# EAGLE design p128b (EAGLE 9.6.2)
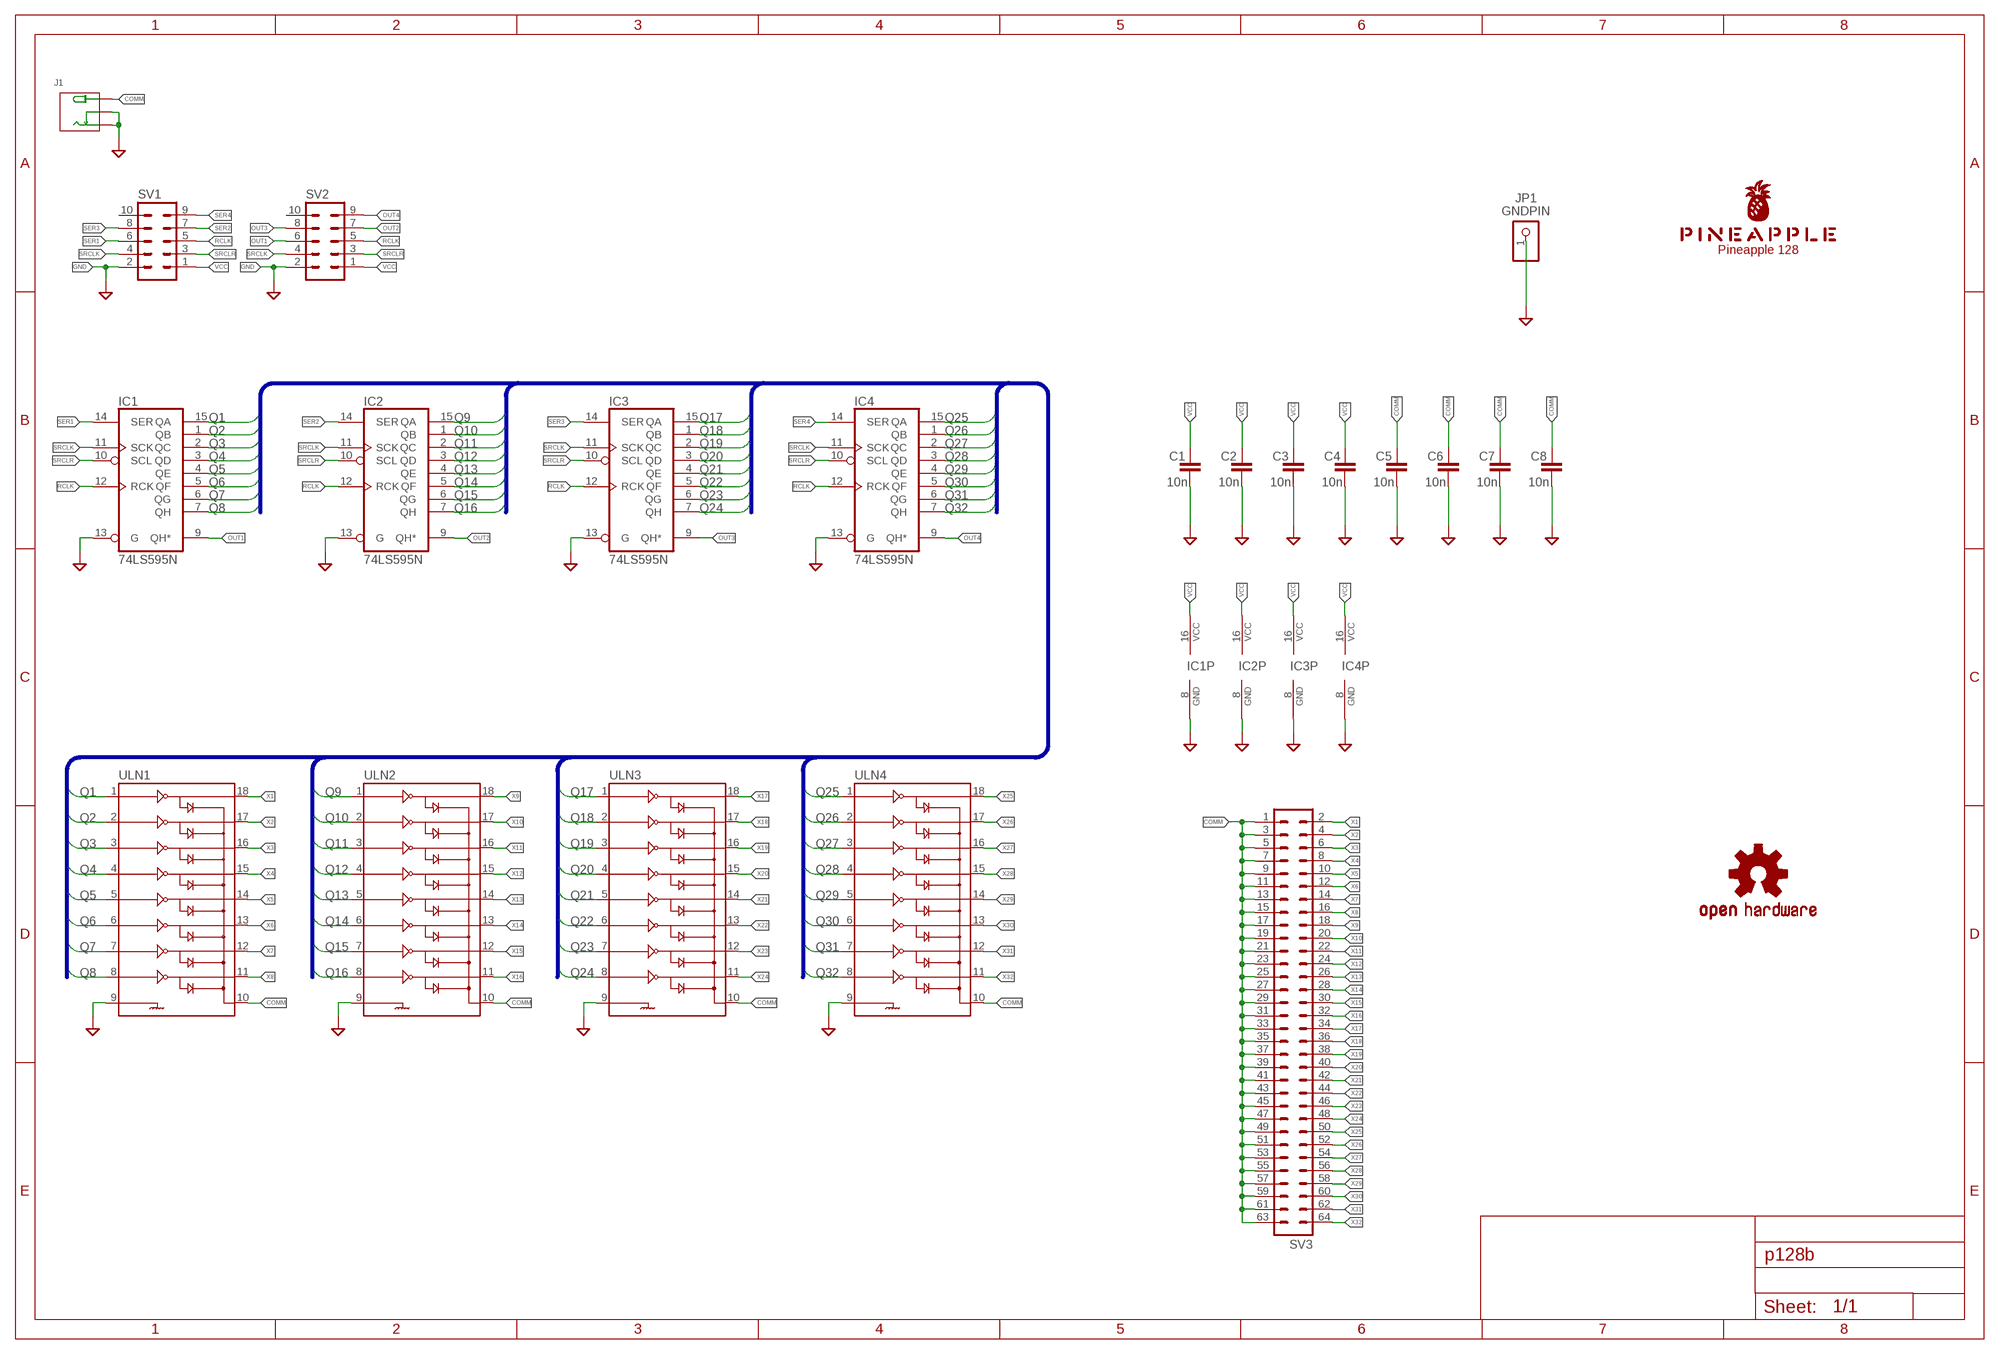
[diagram p0: schematic, sheet 1]

## Parts
C1  10n  C-EU025-024X044  [C025-024X044]
C2  10n  C-EU025-024X044  [C025-024X044]
C3  10n  C-EU025-024X044  [C025-024X044]
C4  10n  C-EU025-024X044  [C025-024X044]
C5  10n  C-EU025-024X044  [C025-024X044]
C6  10n  C-EU025-024X044  [C025-024X044]
C7  10n  C-EU025-024X044  [C025-024X044]
C8  10n  C-EU025-024X044  [C025-024X044]
IC1  74LS595N  [DIL16]
IC2  74LS595N  [DIL16]
IC3  74LS595N  [DIL16]
IC4  74LS595N  [DIL16]
J1  JACK-DC-005'DC-005'  [3P-L14.2*W11.0*H9.0MM]
JP1  GNDPIN  PINHD-1X1  [1X01]
LOGO1  OSHW-LOGOS-COPPER  [OSHW-LOGO-S_COPPER]
SV1  ML10L  [ML10L]
SV2  ML10L  [ML10L]
SV3  ML64L  [ML64L]
U$1  PINEAPPLE450_SILK  [PINEAPPLE450_SILK]
ULN1  ULN2803DIP  [DIL18]
ULN2  ULN2803DIP  [DIL18]
ULN3  ULN2803DIP  [DIL18]
ULN4  ULN2803DIP  [DIL18]

## Nets
COMM [power]: C5.1 C6.1 C7.1 C8.1 J1.+ SV3.1 SV3.3 SV3.5 SV3.7 SV3.9 SV3.11 SV3.13 SV3.15 SV3.17 SV3.19 SV3.21 SV3.23 SV3.25 SV3.27 SV3.29 SV3.31 SV3.33 SV3.35 SV3.37 SV3.39 SV3.41 SV3.43 SV3.45 SV3.47 SV3.49 SV3.51 SV3.53 SV3.55 SV3.57 SV3.59 SV3.61 SV3.63 ULN1.10 ULN2.10 ULN3.10 ULN4.10
GND [gnd]: C1.2 C2.2 C3.2 C4.2 C5.2 C6.2 C7.2 C8.2 IC1.8(GND) IC1.13(G) IC2.8(GND) IC2.13(G) IC3.8(GND) IC3.13(G) IC4.8(GND) IC4.13(G) J1.-1(-) J1.-2(CDN) JP1.1 SV1.2 SV2.2 ULN1.9 ULN2.9 ULN3.9 ULN4.9
OUT1: IC1.9(QH*) SV2.6
OUT2: IC2.9(QH*) SV2.7
OUT3: IC3.9(QH*) SV2.8
OUT4: IC4.9(QH*) SV2.9
Q1: IC1.15(QA) ULN1.1
Q2: IC1.1(QB) ULN1.2
Q3: IC1.2(QC) ULN1.3
Q4: IC1.3(QD) ULN1.4
Q5: IC1.4(QE) ULN1.5
Q6: IC1.5(QF) ULN1.6
Q7: IC1.6(QG) ULN1.7
Q8: IC1.7(QH) ULN1.8
Q9: IC2.15(QA) ULN2.1
Q10: IC2.1(QB) ULN2.2
Q11: IC2.2(QC) ULN2.3
Q12: IC2.3(QD) ULN2.4
Q13: IC2.4(QE) ULN2.5
Q14: IC2.5(QF) ULN2.6
Q15: IC2.6(QG) ULN2.7
Q16: IC2.7(QH) ULN2.8
Q17: IC3.15(QA) ULN3.1
Q18: IC3.1(QB) ULN3.2
Q19: IC3.2(QC) ULN3.3
Q20: IC3.3(QD) ULN3.4
Q21: IC3.4(QE) ULN3.5
Q22: IC3.5(QF) ULN3.6
Q23: IC3.6(QG) ULN3.7
Q24: IC3.7(QH) ULN3.8
Q25: IC4.15(QA) ULN4.1
Q26: IC4.1(QB) ULN4.2
Q27: IC4.2(QC) ULN4.3
Q28: IC4.3(QD) ULN4.4
Q29: IC4.4(QE) ULN4.5
Q30: IC4.5(QF) ULN4.6
Q31: IC4.6(QG) ULN4.7
Q32: IC4.7(QH) ULN4.8
RCLK: IC1.12(RCK) IC2.12(RCK) IC3.12(RCK) IC4.12(RCK) SV1.5 SV2.5
SER1: IC1.14(SER) SV1.6
SER2: IC2.14(SER) SV1.7
SER3: IC3.14(SER) SV1.8
SER4: IC4.14(SER) SV1.9
SRCLK: IC1.11(SCK) IC2.11(SCK) IC3.11(SCK) IC4.11(SCK) SV1.4 SV2.4
SRCLR: IC1.10(SCL) IC2.10(SCL) IC3.10(SCL) IC4.10(SCL) SV1.3 SV2.3
VCC [power]: C1.1 C2.1 C3.1 C4.1 IC1.16(VCC) IC2.16(VCC) IC3.16(VCC) IC4.16(VCC) SV1.1 SV2.1
X1: SV3.2 ULN1.18
X2: SV3.4 ULN1.17
X3: SV3.6 ULN1.16
X4: SV3.8 ULN1.15
X5: SV3.10 ULN1.14
X6: SV3.12 ULN1.13
X7: SV3.14 ULN1.12
X8: SV3.16 ULN1.11
X9: SV3.18 ULN2.18
X10: SV3.20 ULN2.17
X11: SV3.22 ULN2.16
X12: SV3.24 ULN2.15
X13: SV3.26 ULN2.14
X14: SV3.28 ULN2.13
X15: SV3.30 ULN2.12
X16: SV3.32 ULN2.11
X17: SV3.34 ULN3.18
X18: SV3.36 ULN3.17
X19: SV3.38 ULN3.16
X20: SV3.40 ULN3.15
X21: SV3.42 ULN3.14
X22: SV3.44 ULN3.13
X23: SV3.46 ULN3.12
X24: SV3.48 ULN3.11
X25: SV3.50 ULN4.18
X26: SV3.52 ULN4.17
X27: SV3.54 ULN4.16
X28: SV3.56 ULN4.15
X29: SV3.58 ULN4.14
X30: SV3.60 ULN4.13
X31: SV3.62 ULN4.12
X32: SV3.64 ULN4.11
Unconnected: SV1.10 SV2.10

## Buses
Q[1..64]

## Notes on the sheet
- Pineapple 128

## Library data of the parts
C1-C4 C6-C8 = resistor:C-EU: CAPACITOR, European symbol
C5 = rcl:C-EU: CAPACITOR, European symbol; SPICEPREFIX: C
IC1-IC4 = 74xx-us:74*595: 8-bit SHIFT REGISTER, output latch
J1 = Seeed-Connector:JACK-DC-005: 320120003
JP1 = pinhead:PINHD-1X1: PIN HEADER
LOGO1 = SparkFun-Aesthetics:OSHW-LOGO: Open-Source Hardware (OSHW) Logo This logo indicates the piece of hardware it is found on incorporates a OSHW license and/or adheres to the definition of open source hardware found here: http://freedomdefined.org/OSHW
SV1 SV2 = con-ml:ML10L: HARTING; OC_FARNELL: unknown; OC_NEWARK: unknown
SV3 = con-ml:ML64L: HARTING; OC_FARNELL: unknown; OC_NEWARK: unknown
U$1 = pineapple:PINEAPPLE450_SILK
ULN1-ULN4 = SparkFun-IC-Special-Function:ULN2803: Darlington Driver(IC-07959, low stock) ULN2803 Darlington array. 500mA max per channel, 8-channel package. Spark Fun Electronics SKU : COM-00312

## Net classes
0 default: width 0.152 mm, drill 0.152 mm, clearance 0.152 mm
1 gnd: width 0.61 mm, drill 0.152 mm, clearance 0.152 mm
2 power: width 0.61 mm, drill 0.152 mm, clearance 0.152 mm
3 analog: width 0.305 mm, drill 0.152 mm, clearance 0.152 mm

## Board
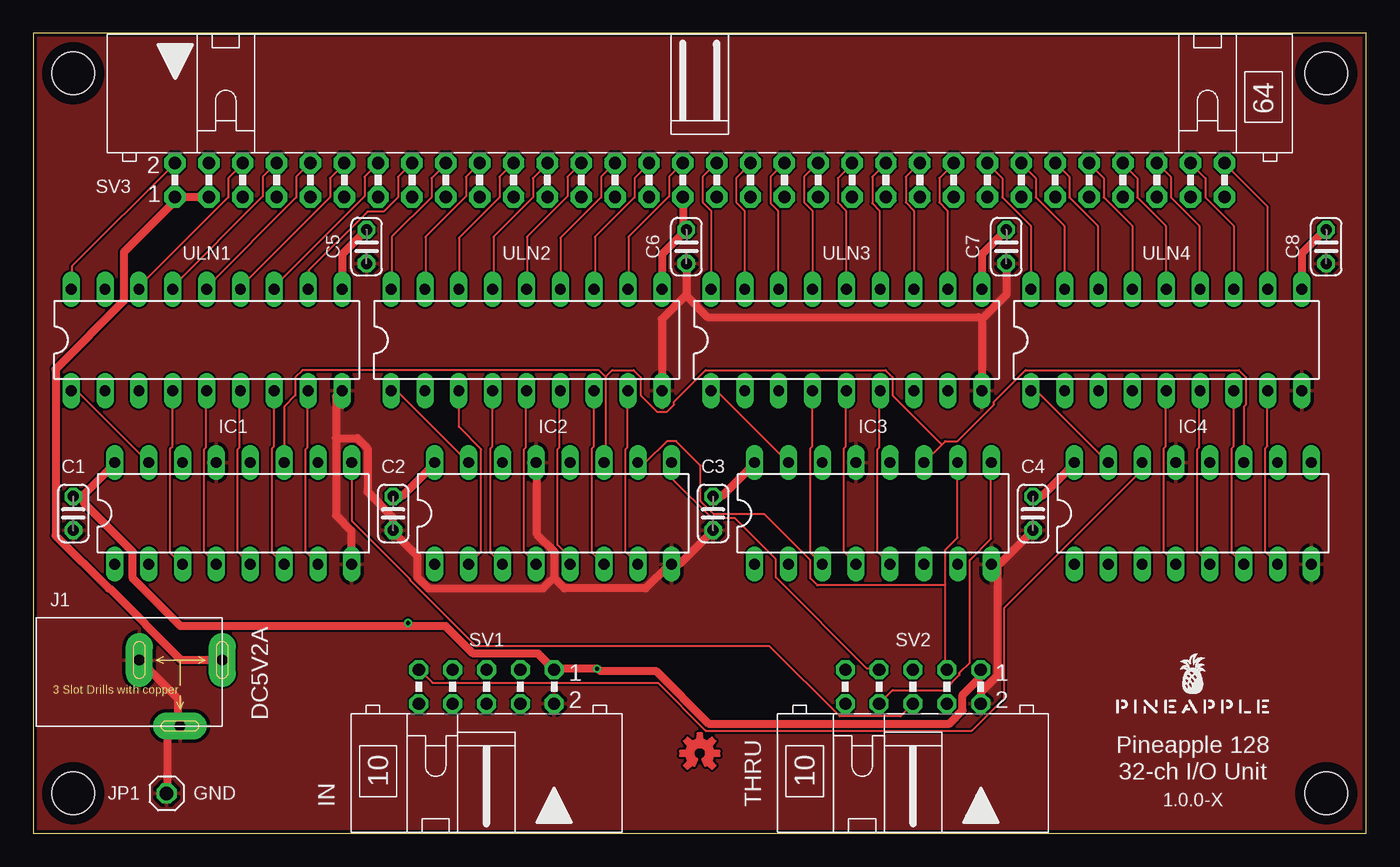
[diagram p1: board, top side]
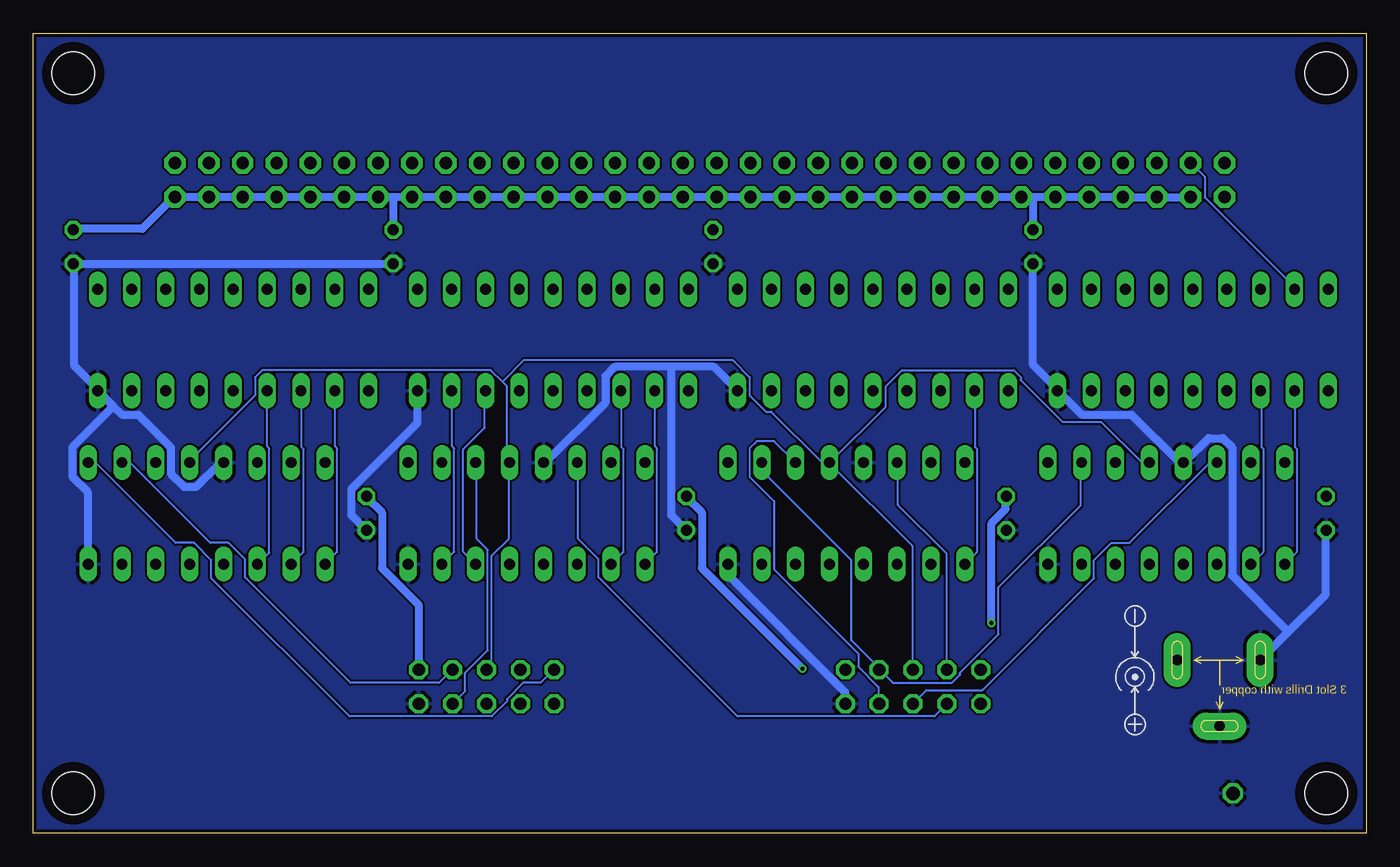
[diagram p2: board, bottom side, seen from below]

Size 100 x 60 mm. Coordinates in mm from the lower left corner, seen from the top.
Outline: 0,0 100,0 100,60 0,60 0,0
Copper layers (1*16): Top 0.035mm / dielectric 1.5mm / Bottom 0.035mm
Design rules "SeeedStudio_2layer_DRU_no_angle_20140221": minimum track width 6mil, minimum drill 12mil, track to track 6mil, track to pad 6mil, pad to pad 6mil, via to via 6mil, smd to smd 0mil, copper to edge 10mil, drill to drill 10mil, minimum pad ring 10mil, minimum via ring 6mil, stop-mask expansion 2mil, vias tented up to drill 100mil, thermal gap 10mil
Holes 3.2 mm at 3,3 97,3 97,57 3,57
tRestrict: area 0.8,54.8 to 5.2,59.2; area 94.8,54.8 to 99.2,59.2; area 0.8,0.8 to 5.2,5.2; area 94.8,0.8 to 99.2,5.2
bRestrict: area 0.8,0.8 to 5.2,5.2; area 94.8,0.8 to 99.2,5.2; area 94.8,54.8 to 99.2,59.2; area 0.8,54.8 to 5.2,59.2

### Footprints (pad centres in the part's own frame; a part is rotated, then mirrored left to right if it is on the bottom)
C025-024X044 = drill 0.813 octagon: 1 -1.27,0; 2 1.27,0
DIL16 = drill 0.813 long: 1 -8.89,-3.81; 2 -6.35,-3.81; 3 -3.81,-3.81; 4 -1.27,-3.81; 5 1.27,-3.81; 6 3.81,-3.81; 7 6.35,-3.81; 8 8.89,-3.81; 9 8.89,3.81; 10 6.35,3.81; 11 3.81,3.81; 12 1.27,3.81; 13 -1.27,3.81; 14 -3.81,3.81; 15 -6.35,3.81; 16 -8.89,3.81
3P-L14.2*W11.0*H9.0MM = drill 0.813 pad 2.032 long: + 3.175,0; -1 -3.048,0; -2 0,-4.953
1X01 = drill 1.016 octagon: 1 0,0
ML10L = drill 0.914 octagon: 1 -5.08,-1.27; 2 -5.08,1.27; 3 -2.54,-1.27; 4 -2.54,1.27; 5 0,-1.27; 6 0,1.27; 7 2.54,-1.27; 8 2.54,1.27; 9 5.08,-1.27; 10 5.08,1.27
ML64L = drill 0.914 pad 1.6 octagon: 1 -39.37,-1.27; 2 -39.37,1.27; 3 -36.83,-1.27; 4 -36.83,1.27; 5 -34.29,-1.27; 6 -34.29,1.27; 7 -31.75,-1.27; 8 -31.75,1.27; 9 -29.21,-1.27; 10 -29.21,1.27; 11 -26.67,-1.27; 12 -26.67,1.27; 13 -24.13,-1.27; 14 -24.13,1.27; 15 -21.59,-1.27; 16 -21.59,1.27; 17 -19.05,-1.27; 18 -19.05,1.27; 19 -16.51,-1.27; 20 -16.51,1.27; 21 -13.97,-1.27; 22 -13.97,1.27; 23 -11.43,-1.27; 24 -11.43,1.27; 25 -8.89,-1.27; 26 -8.89,1.27; 27 -6.35,-1.27; 28 -6.35,1.27; 29 -3.81,-1.27; 30 -3.81,1.27; 31 -1.27,-1.27; 32 -1.27,1.27; 33 1.27,-1.27; 34 1.27,1.27; 35 3.81,-1.27; 36 3.81,1.27; 37 6.35,-1.27; 38 6.35,1.27; 39 8.89,-1.27; 40 8.89,1.27; 41 11.43,-1.27; 42 11.43,1.27; 43 13.97,-1.27; 44 13.97,1.27; 45 16.51,-1.27; 46 16.51,1.27; 47 19.05,-1.27; 48 19.05,1.27; 49 21.59,-1.27; 50 21.59,1.27; 51 24.13,-1.27; 52 24.13,1.27; 53 26.67,-1.27; 54 26.67,1.27; 55 29.21,-1.27; 56 29.21,1.27; 57 31.75,-1.27; 58 31.75,1.27; 59 34.29,-1.27; 60 34.29,1.27; 61 36.83,-1.27; 62 36.83,1.27; 63 39.37,-1.27; 64 39.37,1.27
DIL18 = drill 0.813 long: 1 -10.16,-3.81; 2 -7.62,-3.81; 3 -5.08,-3.81; 4 -2.54,-3.81; 5 0,-3.81; 6 2.54,-3.81; 7 5.08,-3.81; 8 7.62,-3.81; 9 10.16,-3.81; 10 10.16,3.81; 11 7.62,3.81; 12 5.08,3.81; 13 2.54,3.81; 14 0,3.81; 15 -2.54,3.81; 16 -5.08,3.81; 17 -7.62,3.81; 18 -10.16,3.81

### Placement (x,y rotation side)
C1  3,24 270 top
C2  27,24 270 top
C3  51,24 270 top
C4  75,24 270 top
C5  25,44 270 top
C6  49,44 270 top
C7  73,44 270 top
C8  97,44 270 top
IC1  15,24 0 top
IC2  39,24 0 top
IC3  63,24 0 top
IC4  87,24 0 top
J1  11,13 0 top
JP1  10,3 0 top
LOGO1  50,6 0 top
SV1  34,11 180 top
SV2  66,11 180 top
SV3  50,49 0 top
U$1  87,9 0 top
ULN1  13,37 0 top
ULN2  37,37 0 top
ULN3  61,37 0 top
ULN4  85,37 0 top

### Tracks (layer width: path | path; a pad name or v marks a point on that pad's centre or on a via)
COMM
  Top 0.61: ULN4.10 95.17,40.84 95.17,43.51 96.93,45.26 C8.1 | ULN3.10 71.17,40.84 71.17,43.43 C7.1 | ULN2.10 47.17,40.84 47.17,43.43 C6.1 48.77,45.49 48.77,47.7 SV3.31 | ULN1.10 23.16,40.84 23.16,43.43 C5.1 | SV3.3 13.11,47.7 10.67,47.7 SV3.1 10.59,47.4 6.78,43.59 6.78,39.93 1.68,34.82 1.68,22.33 5.64,18.36 5.71,18.36 11.05,13.03 14.17,13.03 J1.+
  Bottom 0.61: 73,47.7 71.86,47.7 SV3.49 71.55,47.7 69.34,47.7 SV3.47 69.04,47.7 66.75,47.7 SV3.45 66.45,47.7 64.24,47.7 SV3.43 63.93,47.7 61.72,47.7 SV3.41 61.42,47.7 59.13,47.7 SV3.39 58.83,47.7 56.62,47.7 SV3.37 56.31,47.7 54.1,47.7 SV3.35 53.8,47.7 51.51,47.7 SV3.33 51.21,47.7 48.77,47.7 SV3.31 48.46,47.7 46.48,47.7 SV3.29 46.18,47.7 43.89,47.7 SV3.27 43.59,47.7 41.38,47.7 SV3.25 41.07,47.7 38.86,47.7 SV3.23 38.56,47.7 36.27,47.7 SV3.21 35.97,47.7 33.76,47.7 SV3.19 33.45,47.7 31.24,47.7 SV3.17 30.94,47.7 28.65,47.7 SV3.15 28.35,47.7 26.14,47.7 SV3.13 25.83,47.7 24.99,47.7 | 73,47.7 74.07,47.7 SV3.51 74.37,47.7 76.66,47.7 SV3.53 76.96,47.7 79.17,47.7 SV3.55 79.48,47.7 81.69,47.7 SV3.57 81.99,47.7 84.28,47.7 SV3.59 84.58,47.7 86.79,47.7 SV3.61 87.1,47.7 89.31,47.7 SV3.63 89.61,47.55 91.82,45.34 96.93,45.34 C8.1 | 73,47.7 73,45.34 C7.1 | 24.99,47.7 23.62,47.7 SV3.11 23.32,47.7 21.03,47.7 SV3.9 20.73,47.7 18.52,47.7 SV3.7 18.21,47.7 15.77,47.7 SV3.5 15.47,47.7 13.18,47.7 SV3.3 | 24.99,47.7 24.99,45.34 C5.1
GND
  Top 0.61: 71.17,38.56 71.17,33.22 ULN3.9 | 71.17,38.56 73,40.39 73,42.67 C7.2 | C4.2 74.98,22.71 72.47,20.19 71.93,20.19 IC3.8 72.31,19.96 72.31,11.81 71.09,10.59 71.09,9.75 SV2.2 | 48.96,40.35 49,40.39 49,42.67 C6.2 | 48.96,40.35 47.17,38.56 47.17,33.22 ULN2.9 | C3.2 50.98,22.71 48.46,20.19 47.93,20.19 IC2.8 47.62,20.04 45.95,18.36 39.85,18.36 39.09,19.13 | 39.09,19.13 39.09,21.11 37.8,22.4 37.8,27.74 IC2.13 | JP1.1 10.06,3.05 10.06,7.09 10.97,8 J1.-2 10.82,8.31 10.82,10.13 8,12.95 J1.-1 | 22.71,29.64 22.71,32.77 23.09,33.15 ULN1.9 | 22.71,29.64 22.71,23.85 23.85,22.71 23.85,20.19 IC1.8 | 22.71,29.64 24.31,29.64 25.07,28.88 25.07,25.6 26.98,23.7 26.98,22.78 C2.2 27.13,22.48 28.8,20.8 28.8,19.2 29.64,18.36 38.25,18.36 38.86,18.97 39.09,19.13 | 48.96,40.35 50.6,38.71 70.94,38.71 71.17,38.56
  Bottom 0.61: 93.99,32.04 95.1,33.15 ULN4.9 95.33,33.45 96.93,35.05 96.93,42.67 C8.2 96.62,42.67 73.08,42.67 C7.2 | 93.99,32.04 93.34,31.39 92.13,31.39 89.69,28.96 89.69,26.98 88.7,25.98 87.78,25.98 86.03,27.74 85.8,27.74 IC4.13 | 93.99,32.04 97.08,28.96 97.08,26.75 95.94,25.6 95.94,20.19 IC4.8 | ULN3.9 71.17,33.15 71.17,30.79 76.12,25.83 76.12,23.85 75.06,22.78 C4.2 | 52.12,34.98 48.92,34.98 47.17,33.22 ULN2.9 | 52.12,34.98 56.39,34.98 57.07,34.29 57.07,32.31 61.57,27.81 IC3.13 | SV1.2 39.09,9.75 39.09,10.59 47.85,19.36 47.85,20.12 IC2.8 | 52.12,34.98 52.12,23.85 51.05,22.78 C3.2 | 5.83,15.13 7.92,13.03 J1.-1 | 5.83,15.13 3.05,17.91 3.05,22.71 C1.2 | C5.2 24.99,42.67 24.99,35.13 23.32,33.45 ULN1.9 23.09,33.15 21.34,31.39 17.6,31.39 14.02,27.81 13.79,27.81 IC1.13 13.49,27.96 11.81,29.64 10.74,29.64 10.06,28.96 10.06,19.36 5.83,15.13
  pour Top: -1,-1 101,-1 101,61 -1,61
  pour Bottom: -2,-2 102,-2 102,62 -2,62
OUT1
  Top 0.152: IC1.9 23.93,27.74 23.93,23.39 28.27,19.05 28.27,18.97 33.22,14.02 55.24,14.02 60.5,8.76 65.08,8.76 65.99,9.68 SV2.6
OUT2
  Top 0.152: IC2.9 47.93,27.74 47.93,26.59 50.9,23.62 52.65,23.62 55.7,20.57 55.7,19.2 62.56,12.34 63.4,12.34 SV2.7
OUT3
  Top 0.152: IC3.9 71.86,27.74 71.86,22.1 70.26,20.5 70.26,12.8 69.49,12.04 69.49,11.89 68.35,10.74 64.47,10.74 63.48,9.75 SV2.8
OUT4
  Bottom 0.152: IC4.9 95.86,27.74 95.25,27.74 89.31,21.79 87.94,21.79 86.64,20.5 86.64,19.13 76.28,8.76 65.61,8.76 64.47,9.91 64.47,10.06 63.25,11.28 61.95,11.28 60.96,12.27 SV2.9
Q1
  Top 0.152: ULN1.1 2.9,33.15 3.28,33.15 8.61,27.81 IC1.15
Q2
  Bottom 0.152: ULN1.2 5.33,33.15 5.33,28.96 5.18,28.8 5.18,21.11 6.1,20.19 IC1.1
Q3
  Bottom 0.152: ULN1.3 7.85,33.15 7.85,28.96 7.7,28.8 7.7,21.11 8.61,20.19 IC1.2
Q4
  Top 0.152: ULN1.4 10.44,33.15 10.44,29.03 10.29,28.88 10.29,21.03 11.12,20.19 IC1.3
Q5
  Top 0.152: ULN1.5 12.95,33.15 12.95,28.96 12.8,28.8 12.8,21.11 13.72,20.19 IC1.4
Q6
  Top 0.152: ULN1.6 15.47,33.15 15.47,28.96 15.32,28.8 15.32,21.11 16.23,20.19 IC1.5
Q7
  Top 0.152: ULN1.7 18.06,33.15 18.06,29.03 17.91,28.88 17.91,21.03 18.75,20.19 IC1.6
Q8
  Top 0.152: ULN1.8 20.57,33.15 20.57,28.96 20.42,28.8 20.42,21.11 21.34,20.19 IC1.7
Q9
  Top 0.152: ULN2.1 26.9,33.15 27.28,33.15 32.61,27.81 IC2.15
Q10
  Bottom 0.152: ULN2.2 29.34,33.15 29.34,28.96 29.18,28.8 29.18,21.11 IC2.1
Q11
  Top 0.152: ULN2.3 31.93,33.15 31.93,30.48 33.6,28.8 33.6,21.11 32.69,20.19 IC2.2
Q12
  Top 0.152: ULN2.4 34.44,33.15 34.44,29.03 34.29,28.88 34.29,21.03 35.13,20.19 IC2.3
Q13
  Top 0.152: ULN2.5 36.96,33.15 36.96,28.96 36.8,28.8 36.8,21.11 IC2.4
Q14
  Top 0.152: ULN2.6 39.47,33.15 39.47,28.96 39.32,28.8 39.32,21.64 40.23,20.73 40.23,20.19 IC2.5
Q15
  Top 0.152: ULN2.7 42.06,33.15 42.06,29.03 41.91,28.88 41.91,21.03 42.75,20.19 IC2.6
Q16
  Top 0.152: ULN2.8 44.58,33.15 44.58,28.96 44.42,28.8 44.42,21.11 45.34,20.19 IC2.7
Q17
  Top 0.152: ULN3.1 50.9,33.15 51.28,33.15 56.62,27.81 IC3.15
Q18
  Bottom 0.152: ULN3.2 53.34,33.15 53.34,29.03 53.19,28.88 53.19,21.11 IC3.1
Q19
  Bottom 0.152: ULN3.3 55.85,33.15 55.85,28.96 55.7,28.8 55.7,21.11 56.62,20.19 IC3.2
Q20
  Top 0.152: ULN3.4 58.45,33.15 58.45,29.03 58.29,28.88 58.29,21.03 59.13,20.19 IC3.3
Q21
  Top 0.152: ULN3.5 60.96,33.15 60.96,29.03 60.81,28.88 60.81,21.11 IC3.4
Q22
  Top 0.152: ULN3.6 63.48,33.15 63.48,28.96 63.32,28.8 63.32,21.11 64.24,20.19 IC3.5
Q23
  Bottom 0.152: ULN3.7 66.14,33.15 66.14,30.4 67.74,28.8 67.74,21.11 66.83,20.19 IC3.6
Q24
  Bottom 0.152: ULN3.8 68.58,33.15 68.58,29.03 68.43,28.88 68.43,21.11 IC3.7
Q25
  Top 0.152: ULN4.1 74.91,33.15 75.29,33.15 80.62,27.81 IC4.15
Q26
  Bottom 0.152: ULN4.2 77.34,33.15 77.34,29.03 77.19,28.88 77.19,21.11 IC4.1
Q27
  Bottom 0.152: ULN4.3 79.86,33.15 79.86,28.96 79.7,28.8 79.7,21.11 80.62,20.19 IC4.2
Q28
  Bottom 0.152: ULN4.4 82.45,33.15 82.45,29.03 82.3,28.88 82.3,21.03 83.13,20.19 IC4.3
Q29
  Top 0.152: ULN4.5 84.96,33.15 84.96,29.03 84.81,28.88 84.81,21.11 IC4.4
Q30
  Top 0.152: ULN4.6 87.48,33.15 87.48,28.96 87.33,28.8 87.33,21.11 88.24,20.19 IC4.5
Q31
  Top 0.152: ULN4.7 90.07,33.15 90.07,29.03 89.92,28.88 89.92,21.03 90.75,20.19 IC4.6
Q32
  Top 0.152: ULN4.8 92.58,33.15 92.58,29.03 92.43,28.88 92.43,21.11 IC4.7
RCLK
  Bottom 0.152: IC1.12 16.31,27.81 16.84,27.81 19.89,30.86 22.78,30.86 25.91,33.98 25.91,34.21 26.44,34.75 34.82,34.75 36.04,33.53 36.04,32 40.23,27.81 IC2.12 | SV1.5 34.06,12.34 34.06,21.57 40.23,27.74 IC2.12 | SV2.5 65.99,12.34 65.61,12.72 65.61,20.8 64.31,22.1 64.31,27.74 IC3.12 64.31,27.81 64.47,27.96 64.47,33.53 64.81,33.87 | 64.81,33.87 65.68,34.75 82.83,34.75 83.36,34.21 83.36,32.84 88.24,27.96 88.24,27.81 IC4.12 | 64.81,33.87 63.17,35.51 47.55,35.51 46.25,34.21 46.25,32.84 45.03,31.62 44.65,31.62 40.84,27.81 40.31,27.81 IC2.12
SER1
  Bottom 0.152: IC1.14 11.2,27.74 11.81,27.74 17.75,21.79 19.13,21.79 20.42,20.5 20.42,19.13 28.8,10.74 32.99,10.74 33.98,9.75 SV1.6
SER2
  Bottom 0.152: IC2.14 35.13,27.74 35.13,24.61 31.47,20.95 31.47,12.34 SV1.7
SER3
  Bottom 0.152: IC3.14 59.13,27.74 59.13,22.1 57.61,20.57 57.61,19.2 47.17,8.76 32.38,8.76 31.47,9.68 SV1.8
SER4
  Top 0.152: IC4.14 83.13,27.74 83.13,27.2 72.85,16.92 72.85,10.13 70.41,7.7 50.44,7.7 46.86,11.28 29.95,11.28 28.96,12.27 SV1.9
SRCLK
  Top 0.152: 68.16,29.15 66.83,27.81 IC3.11 | 68.16,29.15 68.43,29.41 69.34,29.41 72.08,32.16 72.08,32.38 74.45,34.75 90.45,34.75 90.98,34.21 90.98,32.16 90.83,32 90.83,27.81 IC4.11 | 42.94,34.25 42.98,34.21 42.98,27.96 42.82,27.81 IC2.11 | 42.94,34.25 42.44,34.75 20.19,34.75 19.66,34.21 19.66,32.84 18.82,32 18.82,27.81 IC1.11 | 68.16,29.15 64.47,32.84 64.47,34.21 63.93,34.75 50.44,34.75 48.08,32.38 48.08,32.16 47.55,31.62 46.79,31.62 45.57,32.84 45.57,34.21 45.03,34.75 43.43,34.75 42.94,34.25
  Bottom 0.152: IC3.11 66.75,27.74 66.75,22.1 65.91,21.26 65.91,13.72 67.59,12.04 67.59,10.67 68.5,9.75 SV2.4 | SV1.4 36.58,9.75 36.58,10.97 38.1,12.5 38.1,13.49 44.42,19.81 44.42,24.92 46.25,26.75 46.25,28.88 45.72,29.41 44.42,29.41 42.82,27.81 IC2.11
SRCLR
  Top 0.152: 68.43,18.59 68.43,12.42 68.5,12.34 SV2.3 | 68.43,18.59 68.43,21.26 69.34,22.17 69.34,27.74 IC3.10 | 68.43,18.59 58.83,18.59 58.29,19.13 58.29,20.5 54.86,23.93 51.05,23.93 50.06,24.92 50.06,27.58 48.23,29.41 47.55,29.41 45.95,27.81 45.41,27.81 IC2.10
  Bottom 0.152: IC1.10 21.41,27.74 21.41,24.61 27.58,18.44 27.58,14.94 30.48,12.04 30.48,11.89 31.09,11.28 35.51,11.28 36.5,12.27 SV1.3 36.5,12.34 38.63,14.48 38.63,20.5 45.34,27.2 45.34,27.74 IC2.10 | IC4.10 93.34,27.74 92.66,27.74 86.72,21.79 85.34,21.79 84.12,20.57 84.12,19.2 76.2,11.28 69.57,11.28 68.58,12.27 SV2.3
VCC  (via drill 0.3)
  Top 0.61: C4.1 75.06,25.3 75.67,25.3 78.11,27.74 IC4.16 | C2.1 27.05,25.3 27.66,25.3 30.1,27.74 IC2.16 | 3.66,25.3 3.05,25.3 C1.1 | 3.66,25.3 6.1,27.74 IC1.16 | C3.1 51.05,25.3 51.66,25.3 54.1,27.74 IC3.16 | 28.12,15.54 30.94,15.54 32.99,13.49 37.87,13.49 38.86,12.5 SV1.1 39.09,12.34 v42.29,12.34 42.52,12.19 46.71,12.19 50.67,8.23 68.73,8.23 69.72,9.22 69.72,10.36 71.02,11.66 71.02,12.27 SV2.1 | 28.12,15.54 11.05,15.54 7.47,19.13 7.47,21.11 3.81,24.77 3.81,25.07 3.66,25.3 | v28.12,15.77 28.12,15.54
  Bottom 0.61: SV2.1 71.09,12.34 71.09,17.14 73.84,19.89 73.84,24.08 74.98,25.22 C4.1 | v42.29,12.34 49.84,19.89 49.84,24.08 50.98,25.22 C3.1 | v28.12,15.77 28.12,23.24 27.05,24.31 27.05,25.22 C2.1
X1
  Top 0.152: ULN1.18 2.9,40.84 2.9,42.52 10.59,50.22 SV3.2
X2
  Bottom 0.152: ULN1.17 5.41,40.84 5.41,41 12.12,47.7 12.12,49.23 13.11,50.22 SV3.4
X3
  Top 0.152: ULN1.16 7.92,40.84 7.92,41 14.63,47.7 14.63,49.15 15.7,50.22 SV3.6
X4
  Top 0.152: ULN1.15 10.52,40.84 10.52,41.07 17.22,47.78 17.22,49.23 18.21,50.22 SV3.8
X5
  Top 0.152: ULN1.14 13.03,40.84 13.03,41 19.74,47.7 19.74,49.23 20.73,50.22 SV3.10
X6
  Top 0.152: ULN1.13 15.54,40.84 15.54,41 22.25,47.7 22.25,49.15 23.32,50.22 SV3.12
X7
  Top 0.152: ULN1.12 18.14,40.84 18.14,41.07 24.84,47.78 24.84,49.23 25.83,50.22 SV3.14
X8
  Top 0.152: ULN1.11 20.65,40.84 20.65,42.22 25.07,46.63 26.29,46.63 27.36,47.7 27.36,49.23 28.35,50.22 SV3.16
X9
  Top 0.152: ULN2.18 26.9,40.84 26.9,44.73 29.87,47.7 29.87,49.15 30.94,50.22 SV3.18
X10
  Top 0.152: ULN2.17 29.41,40.84 29.41,44.73 32.46,47.78 32.46,49.23 33.45,50.22 SV3.20
X11
  Top 0.152: ULN2.16 31.93,40.84 31.93,44.65 34.98,47.7 34.98,49.23 35.97,50.22 SV3.22
X12
  Top 0.152: ULN2.15 34.52,40.84 34.52,44.73 37.49,47.7 37.49,49.15 38.56,50.22 SV3.24
X13
  Top 0.152: ULN2.14 37.03,40.84 37.03,44.73 40.08,47.78 40.08,49.23 41.07,50.22 SV3.26
X14
  Top 0.152: ULN2.13 39.55,40.84 39.55,44.65 42.6,47.7 42.6,49.23 43.59,50.22 SV3.28
X15
  Top 0.152: ULN2.12 42.14,40.84 42.14,44.73 45.11,47.7 45.11,49.15 46.18,50.22 SV3.30
X16
  Top 0.152: ULN2.11 44.65,40.84 44.65,44.73 47.7,47.78 47.7,49.23 48.69,50.22 SV3.32
X17
  Top 0.152: ULN3.18 50.83,40.84 50.83,46.71 50.22,47.32 50.22,49.23 51.21,50.22 SV3.34
X18
  Top 0.152: ULN3.17 53.34,40.84 53.34,46.71 52.73,47.32 52.73,49.15 53.8,50.22 SV3.36
X19
  Top 0.152: ULN3.16 55.85,40.84 55.85,46.71 55.32,47.24 55.32,49.23 56.31,50.22 SV3.38
X20
  Top 0.152: ULN3.15 58.45,40.84 58.45,46.71 57.84,47.32 57.84,49.23 58.83,50.22 SV3.40
X21
  Top 0.152: ULN3.14 60.96,40.84 60.96,46.71 60.35,47.32 60.35,49.15 61.42,50.22 SV3.42
X22
  Top 0.152: ULN3.13 63.48,40.84 63.48,46.71 62.94,47.24 62.94,49.23 63.93,50.22 SV3.44
X23
  Top 0.152: ULN3.12 66.06,40.84 66.06,46.71 65.46,47.32 65.46,49.23 66.45,50.22 SV3.46
X24
  Top 0.152: ULN3.11 68.58,40.84 68.58,46.71 67.97,47.32 67.97,49.15 69.04,50.22 SV3.48
X25
  Top 0.152: ULN4.18 74.83,40.84 74.83,45.57 72.69,47.7 72.69,49.15 71.63,50.22 SV3.50
X26
  Top 0.152: ULN4.17 77.34,40.84 77.34,45.57 75.21,47.7 75.21,49.15 74.14,50.22 SV3.52
X27
  Top 0.152: ULN4.16 79.86,40.84 79.86,45.57 77.72,47.7 77.72,49.23 76.73,50.22 SV3.54
X28
  Top 0.152: ULN4.15 82.45,40.84 82.45,45.57 80.31,47.7 80.31,49.15 79.25,50.22 SV3.56
X29
  Top 0.152: ULN4.14 84.96,40.84 84.96,45.57 82.83,47.7 82.83,49.15 81.76,50.22 SV3.58
X30
  Top 0.152: ULN4.13 87.48,40.84 87.48,45.57 85.34,47.7 85.34,49.23 84.35,50.22 SV3.60
X31
  Top 0.152: ULN4.12 90.07,40.84 90.07,45.57 87.94,47.7 87.94,49.15 86.87,50.22 SV3.62
X32
  Top 0.152: ULN4.11 92.58,40.84 92.58,47.02 89.38,50.22 SV3.64

### Text on the board
tNames: DC5V2A | Pineapple 128 | 32-ch I/O Unit | GND | IN | THRU | 1.0.0-X